# Altium schematic sheet Camera_LED_Module.SchDoc: Camera LED Ring Module
size A4; DrawnBy: Samyar Sadat Akhavi; Revision: 1.0; SheetNumber: 1; SheetTotal: 3
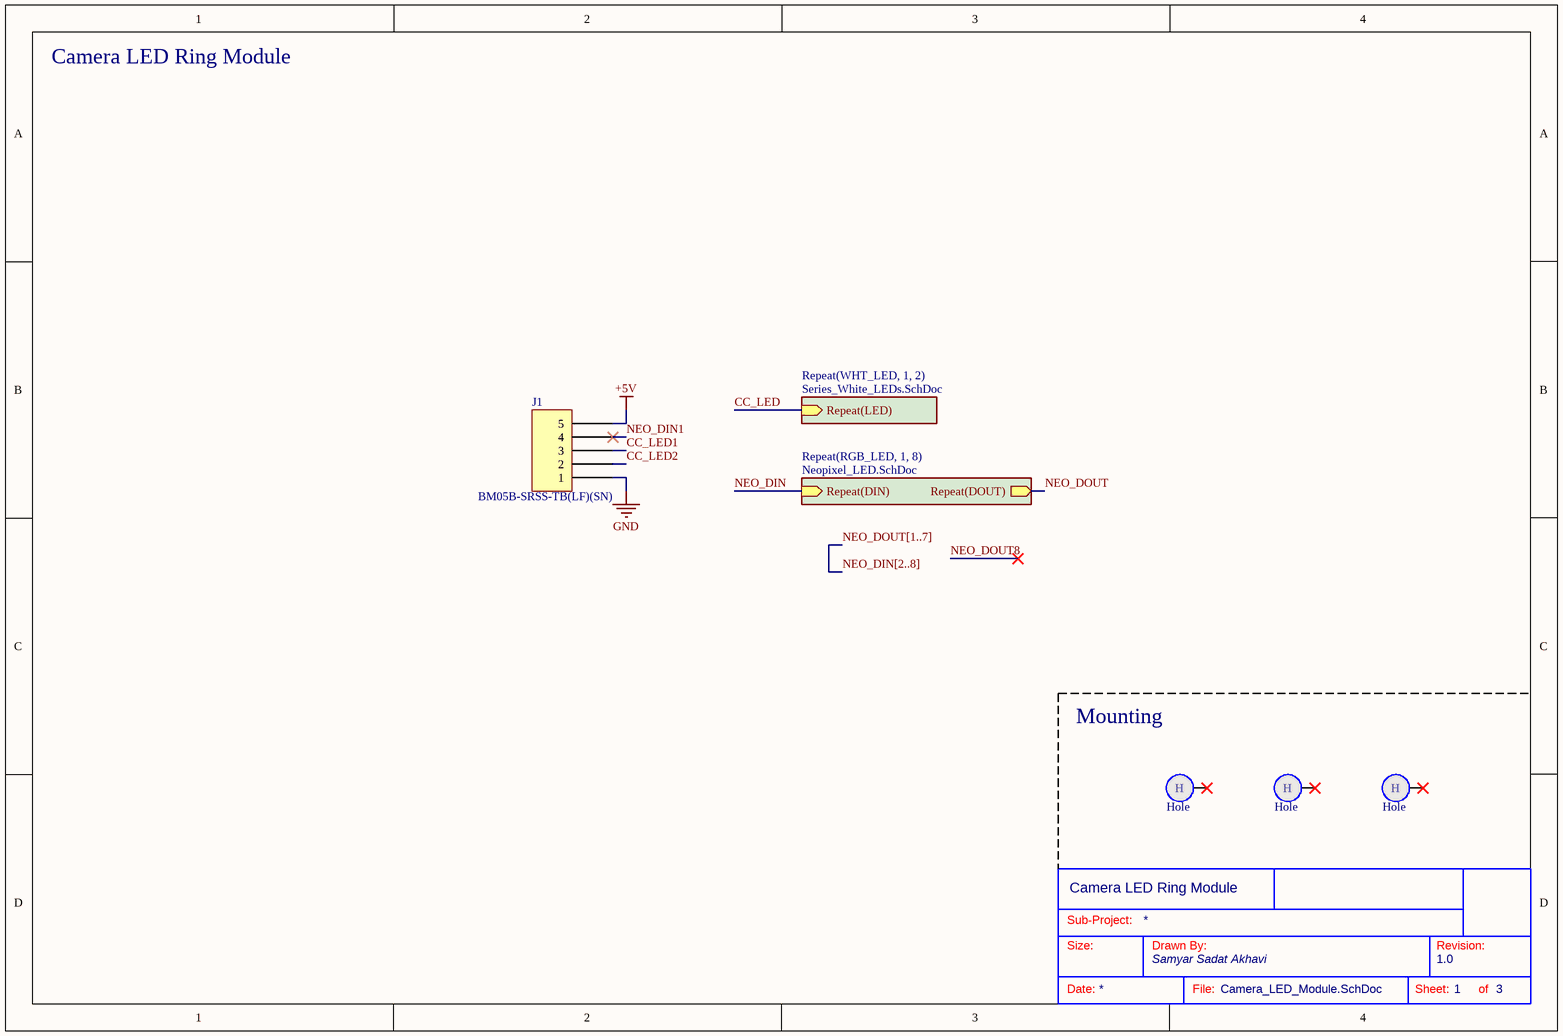
[diagram p0: Camera_LED_Module.SchDoc]

## Parts
?  (no value)  (graphical)
Hole1  Hole  [Hole_2mm]  (no BOM)
Hole2  Hole  [Hole_2mm]  (no BOM)
Hole3  Hole  [Hole_2mm]  (no BOM)
J1  BM05B-SRSS-TB(LF)(SN)  [JST BM05B-SRSS-TB]

## Sub-sheets
Repeat(RGB_LED, 1, 8) = Neopixel_LED.SchDoc: Repeat(DIN) (in), Repeat(DOUT) (out)
Repeat(WHT_LED, 1, 2) = Series_White_LEDs.SchDoc: Repeat(LED) (in)

## Nets
+5V: J1.5
GND: J1.1
CC_LED: sheet Repeat(WHT_LED, 1, 2)/Repeat(LED)
CC_LED1: J1.3
CC_LED2: J1.2
NEO_DIN: sheet Repeat(RGB_LED, 1, 8)/Repeat(DIN)
NEO_DIN1: J1.4
NEO_DOUT: sheet Repeat(RGB_LED, 1, 8)/Repeat(DOUT)

Not connected (* = marked no-connect by the designer): Hole1 1*; Hole2 1*; Hole3 1*

## Buses and harness runs
bus NEO_DIN[2..8] = NEO_DOUT[1..7]

## Notes on the sheet
- Camera LED Ring Module
- Mounting
- Sub-Project:
- Size:
- Drawn By:
- Revision:
- Date:
- File:
- Sheet:
- of
- (in symbol Hole) H

## Library data of the parts
? = Standard Title Block
J1 = BM05B-SRSS-TB(LF)(SN): CONN HEADER SMD 5POS 1MM; Manufacturer: JST Sales America Inc.; Current Rating (Amps): 0.7A; Material Flammability Rating: UL94 V-0; Number of Positions: 5; Number of Positions Loaded: All; Pitch - Mating: 0.039" (1.00mm); Shrouding: Shrouded - 4 Wall; Style: Board to Cable/Wire; Voltage Rating: 50V; Part Number: BM05B-SRSS-TB(LF)(SN); ComponentLink1Description: Datasheet; ComponentLink1URL: http://www.jst-mfg.com/product/pdf/eng/eSR.pdf; ComponentLink2Description: DigiKey Link; ComponentLink2URL: http://digikey.com/product-detail/en/jst-sales-america-inc/BM05B-SRSS-TB-LF-SN/455-1791-1-ND/926862; Connector Type: Header; Contact Finish - Mating: Tin; Contact Finish - Post: Tin; Contact Material: Copper Alloy; Contact Shape: Square; Contact Type: Male Pin; Fastening Type: Push-Pull; Features: Solder Retention; Insulation Color: Natural; Insulation Height: 0.167" (4.25mm); Insulation Material: Polyamide (PA), Nylon; LastUpdated: 1/12/2020 10:14:00 PM; Lifecycle Status: Active; Minimum Order: 1; Mounting Type: Surface Mount; Number of Rows: 1; Operating Temperature: -25°C ~ 85°C; Packaging: TapeAndReel; PartId: 18; Part Status: Active; Price: 0.35; Series: SR; Supplier 1: DigiKey; Supplier Part Number 1: 455-1791-1-ND; Termination: Solder